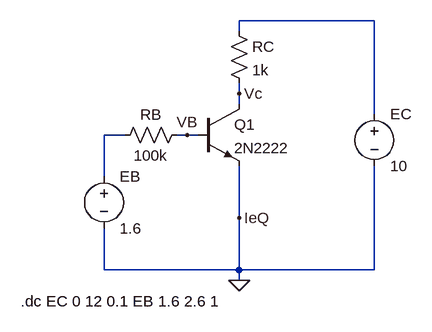
[diagram p0: schematic Draft2.asc]
Draft2.asc, the LTspice schematic file:
Version 4
SHEET 1 880 680
WIRE 400 -112 192 -112
WIRE 192 -96 192 -112
WIRE 192 0 192 -16
WIRE 192 16 192 0
WIRE 400 32 400 -112
WIRE 16 64 -16 64
WIRE 112 64 96 64
WIRE 128 64 112 64
WIRE -16 128 -16 64
WIRE 192 192 192 112
WIRE -16 272 -16 208
WIRE 192 272 192 192
WIRE 192 272 -16 272
WIRE 400 272 400 112
WIRE 400 272 192 272
WIRE 192 288 192 272
FLAG 192 288 0
FLAG 192 0 Vc
FLAG 192 192 IeQ
FLAG 112 64 VB
SYMBOL npn 128 16 R0
SYMATTR InstName Q1
SYMATTR Value 2N2222
SYMBOL res 176 -112 R0
SYMATTR InstName RC
SYMATTR Value 1k
SYMBOL res 112 48 R90
WINDOW 0 0 56 VBottom 2
WINDOW 3 32 56 VTop 2
SYMATTR InstName RB
SYMATTR Value 100k
SYMBOL voltage 400 16 R0
SYMATTR InstName EC
SYMATTR Value 10
SYMBOL voltage -16 112 R0
SYMATTR InstName EB
SYMATTR Value 1.6
TEXT -144 320 Left 2 !.dc EC 0 12 0.1 EB 1.6 2.6 1

The netlist it stands for:
* Draft2.asc
Q1 Vc VB 0 0 2N2222
RC N001 Vc 1k
RB VB N002 100k
V§EC N001 0 10
V§EB N002 0 1.6
.model NPN NPN
.model PNP PNP
.lib standard.bjt
.dc EC 0 12 0.1 EB 1.6 2.6 1
.backanno
.end

* Results of the author's LTspice run, read from the files saved beside the schematic
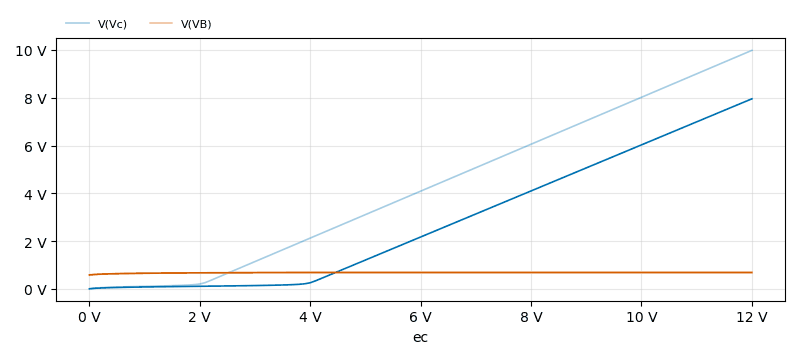
[diagram p1: DC transfer characteristic of Draft2.asc, plotted from the saved traces]
* DC transfer characteristic, 2 runs:
*   V(Vc) [v§eb=1.6]: 4.452 mV at ec=0 V, 9.983 V at ec=12 V, min 4.452 mV, max 9.983 V
*   V(Vc) [v§eb=2.6]: 5.579 mV at ec=0 V, 7.955 V at ec=12 V, min 5.579 mV, max 7.955 V
*   V(VB) [v§eb=1.6]: 569.3 mV at ec=0 V, 671.6 mV at ec=12 V, min 569.3 mV, max 671.6 mV
*   V(VB) [v§eb=2.6]: 587.8 mV at ec=0 V, 690.8 mV at ec=12 V, min 587.8 mV, max 690.8 mV